# EAGLE design Player Module (EAGLE 9.3.0)
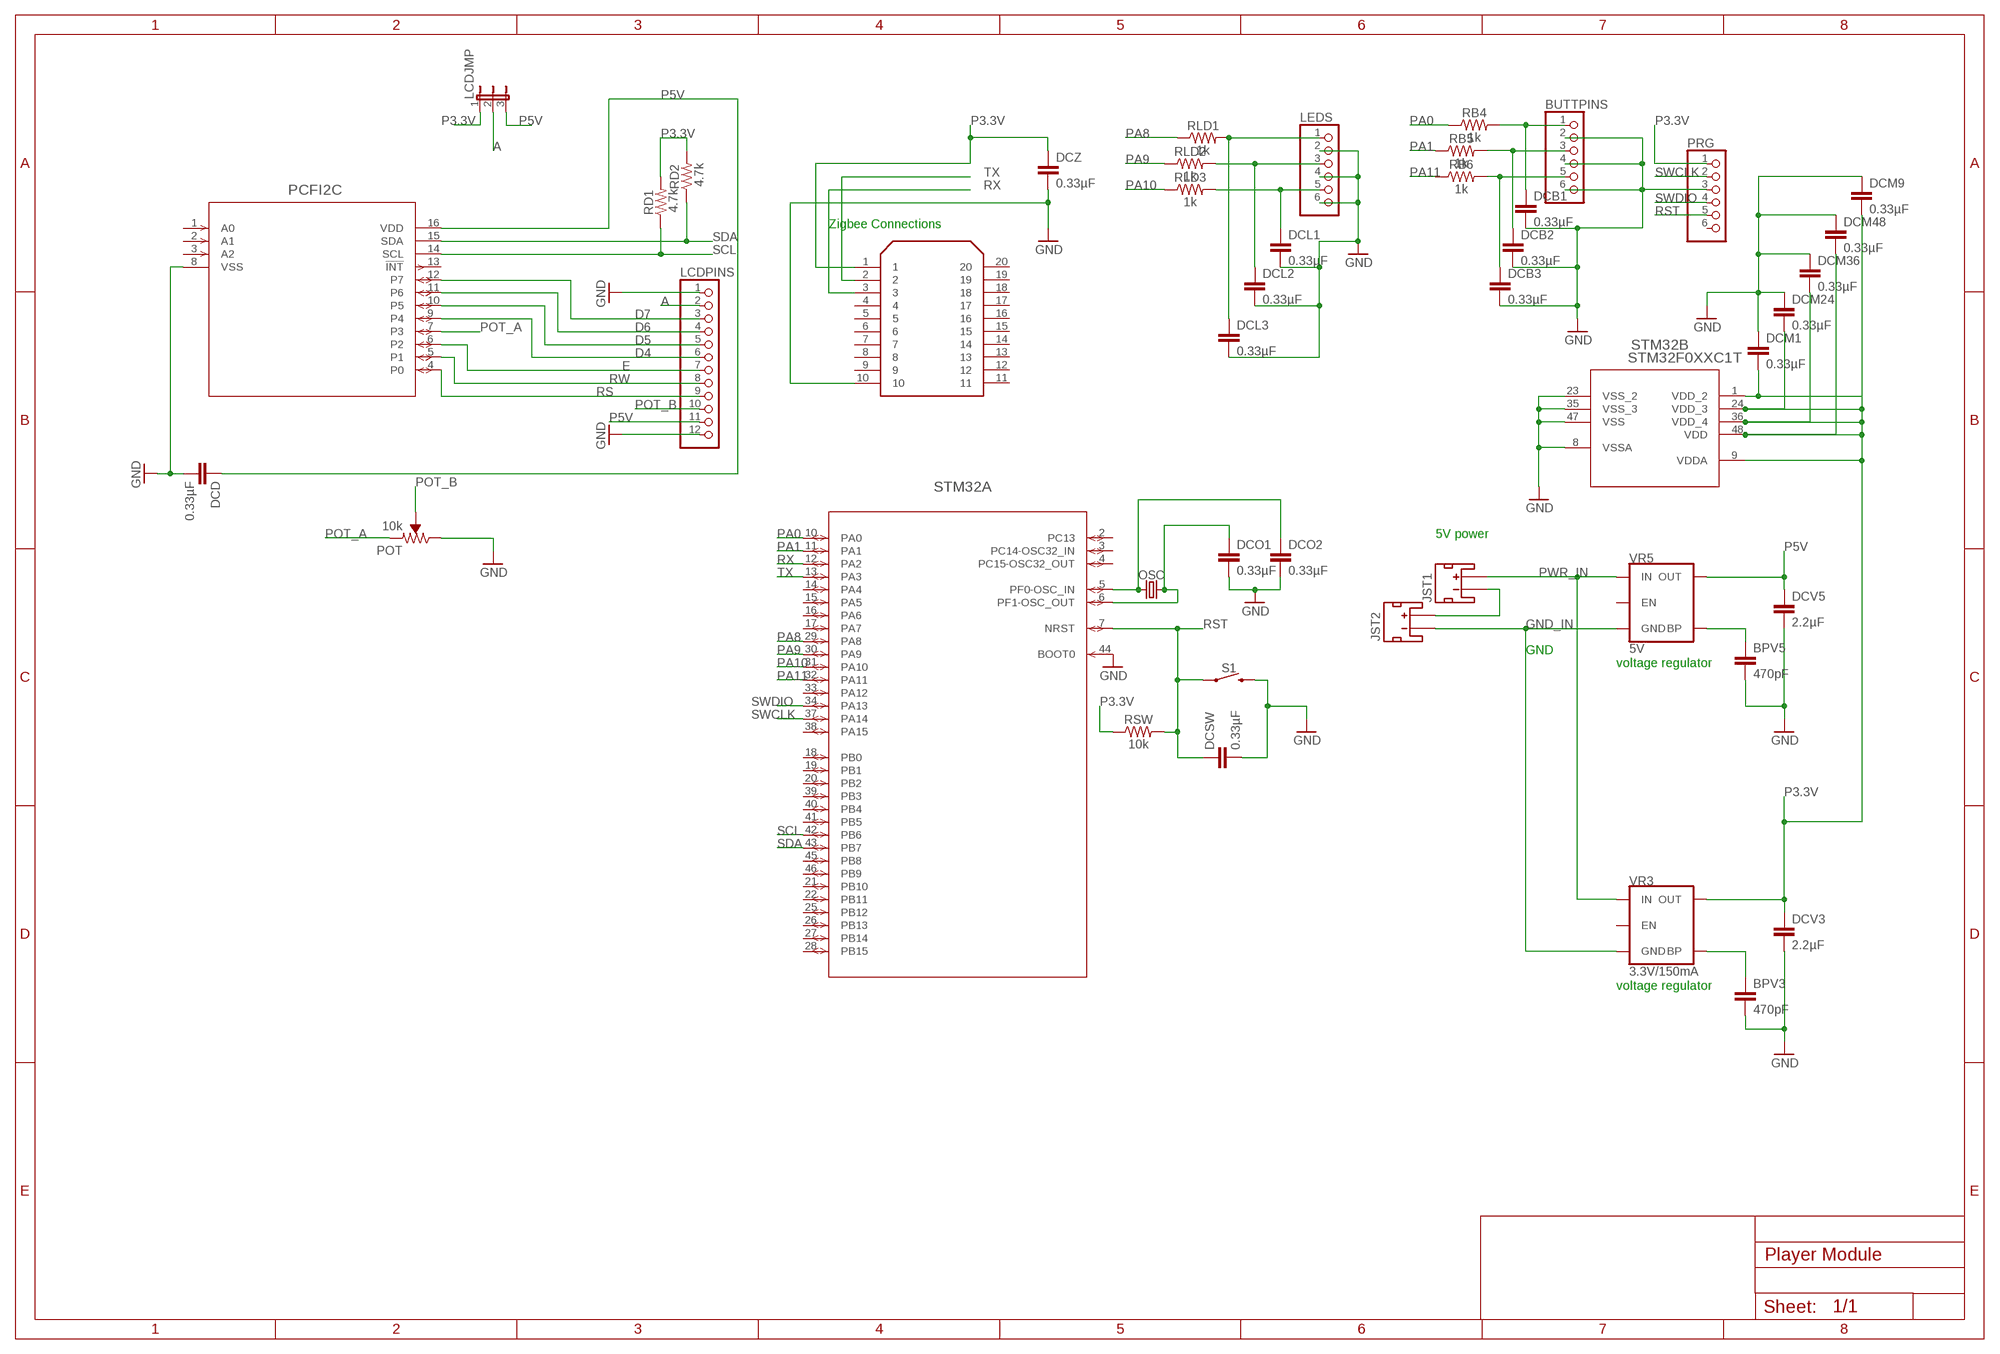
[diagram p0: schematic, sheet 1]

## Parts
BPV3  470pF  0.33UF/330NF-0805-50V-10%  [0805]
BPV5  470pF  0.33UF/330NF-0805-50V-10%  [0805]
BUTTPINS  PINHD-1X6  [1X06]
DCB1  0.33µF  0.33UF/330NF-0805-50V-10%  [0805]
DCB2  0.33µF  0.33UF/330NF-0805-50V-10%  [0805]
DCB3  0.33µF  0.33UF/330NF-0805-50V-10%  [0805]
DCD  0.33µF  0.33UF/330NF-0805-50V-10%  [0805]
DCL1  0.33µF  0.33UF/330NF-0805-50V-10%  [0805]
DCL2  0.33µF  0.33UF/330NF-0805-50V-10%  [0805]
DCL3  0.33µF  0.33UF/330NF-0805-50V-10%  [0805]
DCM1  0.33µF  0.33UF/330NF-0805-50V-10%  [0805]
DCM9  0.33µF  0.33UF/330NF-0805-50V-10%  [0805]
DCM24  0.33µF  0.33UF/330NF-0805-50V-10%  [0805]
DCM36  0.33µF  0.33UF/330NF-0805-50V-10%  [0805]
DCM48  0.33µF  0.33UF/330NF-0805-50V-10%  [0805]
DCO1  0.33µF  0.33UF/330NF-0805-50V-10%  [0805]
DCO2  0.33µF  0.33UF/330NF-0805-50V-10%  [0805]
DCSW  0.33µF  0.33UF/330NF-0805-50V-10%  [0805]
DCV3  2.2µF  0.33UF/330NF-0805-50V-10%  [0805]
DCV5  2.2µF  0.33UF/330NF-0805-50V-10%  [0805]
DCZ  0.33µF  0.33UF/330NF-0805-50V-10%  [0805]
JST1  JST_2MM_MALE  [JST-2-SMD]
JST2  JST_2MM_MALE  [JST-2-SMD]
LCDJMP  JP2E  [JP2]
LCDPINS  PINHD-1X12  [1X12]
LEDS  PINHD-1X6  [1X06]
OSC  CRYSTALPTH-HC49US  [HC49US]
PCFI2C  PCF8574T/3,512SOT162-1-M  [SOT162-1-M]
POT  10k  TRIMPOT-PTH-10MM-KNOB-1/2W-10%  [TRIMPOT-PTH-3386U]
PRG  PINHD-1X6  [1X06]
RB4  1k  RESISTOR0805  [0805]
RB5  1k  RESISTOR0805  [0805]
RB6  1k  RESISTOR0805  [0805]
RD1  4.7k  RESISTOR0805  [0805]
RD2  4.7k  RESISTOR0805  [0805]
RLD1  1k  RESISTOR0805  [0805]
RLD2  1k  RESISTOR0805  [0805]
RLD3  1k  RESISTOR0805  [0805]
RSW  10k  RESISTOR0805  [0805]
S1  MOMENTARY-SWITCH-SPST-SMD-5.2MM  [TACTILE_SWITCH_SMD_5.2MM]
STM32  STM32F0XXC1T  [LQFP48-7X7MM]
VR3  3.3V/150mA  V_REG_MIC52053.3V  [SOT23-5]
VR5  5V  V_REG_MIC52055V  [SOT23-5]
XBEE  XB24-BPIT-004  [DIP-20]

## Nets
A: LCDJMP.2 LCDPINS.2
D4: LCDPINS.6 PCFI2C.9(P4)
D5: LCDPINS.5 PCFI2C.10(P5)
D6: LCDPINS.4 PCFI2C.11(P6)
D7: LCDPINS.3 PCFI2C.12(P7)
E: LCDPINS.7 PCFI2C.6(P2)
GND: BPV3.2 BPV5.2 BUTTPINS.2 BUTTPINS.4 BUTTPINS.6 DCB1.2 DCB2.2 DCB3.2 DCD.2 DCL1.2 DCL2.2 DCL3.2 DCM1.1 DCM9.1 DCM24.1 DCM36.1 DCM48.1 DCO1.2 DCO2.2 DCSW.2 DCV3.2 DCV5.2 DCZ.2 LCDPINS.1 LCDPINS.12 LEDS.2 LEDS.4 LEDS.6 PCFI2C.8(VSS) POT.3(CW) PRG.3 S1.3 STM32.8(B:VSSA) STM32.23(B:VSS_2) STM32.35(B:VSS_3) STM32.44(A:BOOT0) STM32.47(B:VSS) XBEE.10
GND_IN: JST2.1(-) VR3.2(GND) VR5.2(GND)
N$1: JST1.1(-) JST2.2(+)
N$3: DCL3.1 LEDS.1 RLD1.2
N$4: DCL2.1 LEDS.3 RLD2.2
N$5: DCL1.1 LEDS.5 RLD3.2
N$8: BUTTPINS.1 DCB1.1 RB4.2
N$13: BUTTPINS.3 DCB2.1 RB5.2
N$17: BUTTPINS.5 DCB3.1 RB6.2
N$21: DCO2.1 OSC.1 STM32.5(A:PF0-OSC_IN)
N$22: DCO1.1 OSC.2 STM32.6(A:PF1-OSC_OUT)
N$34: BPV3.1 VR3.4(BP)
N$37: BPV5.1 VR5.4(BP)
P3.3V: DCM1.2 DCM9.2 DCM24.2 DCM36.2 DCM48.2 DCV3.1 DCZ.1 LCDJMP.1 PRG.1 RD1.2 RD2.2 RSW.1 STM32.1(B:VDD_2) STM32.9(B:VDDA) STM32.24(B:VDD_3) STM32.36(B:VDD_4) STM32.48(B:VDD) VR3.5(OUT) XBEE.1
P5V: DCD.1 DCV5.1 LCDJMP.3 LCDPINS.11 PCFI2C.16(VDD) VR5.5(OUT)
PA0: RB4.1 STM32.10(A:PA0)
PA1: RB5.1 STM32.11(A:PA1)
PA8: RLD1.1 STM32.29(A:PA8)
PA9: RLD2.1 STM32.30(A:PA9)
PA10: RLD3.1 STM32.31(A:PA10)
PA11: RB6.1 STM32.32(A:PA11)
POT_A: PCFI2C.7(P3) POT.1(CCW)
POT_B: LCDPINS.10 POT.2(WIPER)
PWR_IN: JST1.2(+) VR3.1(IN) VR5.1(IN)
RS: LCDPINS.9 PCFI2C.4(P0)
RST: DCSW.1 PRG.5 RSW.2 S1.1 STM32.7(A:NRST)
RW: LCDPINS.8 PCFI2C.5(P1)
RX: STM32.12(A:PA2) XBEE.3
SCL: PCFI2C.14(SCL) RD1.1 STM32.42(A:PB6)
SDA: PCFI2C.15(SDA) RD2.1 STM32.43(A:PB7)
SWCLK: PRG.2 STM32.37(A:PA14)
SWDIO: PRG.4 STM32.34(A:PA13)
TX: STM32.13(A:PA3) XBEE.2
Unconnected: JST1.NC1(PAD1) JST1.NC2(PAD2) JST2.NC1(PAD1) JST2.NC2(PAD2) PCFI2C.1(A0) PCFI2C.2(A1) PCFI2C.3(A2) PCFI2C.13(!INT) PRG.6 STM32.2(A:PC13) STM32.3(A:PC14-OSC32_IN) STM32.4(A:PC15-OSC32_OUT) STM32.14(A:PA4) STM32.15(A:PA5) STM32.16(A:PA6) STM32.17(A:PA7) STM32.18(A:PB0) STM32.19(A:PB1) STM32.20(A:PB2) STM32.21(A:PB10) STM32.22(A:PB11) STM32.25(A:PB12) STM32.26(A:PB13) STM32.27(A:PB14) STM32.28(A:PB15) STM32.33(A:PA12) STM32.38(A:PA15) STM32.39(A:PB3) STM32.40(A:PB4) STM32.41(A:PB5) STM32.45(A:PB8) STM32.46(A:PB9) VR3.3(EN) VR5.3(EN) XBEE.4 XBEE.5 XBEE.6 XBEE.7 XBEE.8 XBEE.9 XBEE.11 XBEE.12 XBEE.13 XBEE.14 XBEE.15 XBEE.16 XBEE.17 XBEE.18 XBEE.19 XBEE.20

## Notes on the sheet
- Zigbee Connections
- 5V power
- GND
- voltage regulator
- voltage regulator

## Library data of the parts
BPV3 BPV5 DCV3 DCV5 = SparkFun-Capacitors:0.33UF/330NF: 0.33µF/330nF ceramic capacitors A capacitor is a passive two-terminal electrical component used to store electrical energy temporarily in an electric field.; PROD_ID: CAP-08469; VALUE: 0.33µF
BUTTPINS LEDS PRG = pinhead:PINHD-1X6: PIN HEADER
DCB1-DCB3 DCD DCL1-DCL3 DCM1 DCM9 DCM24 DCM36 DCM48 DCO1 DCO2 DCSW DCZ = SparkFun-Capacitors:0.33UF/330NF: 0.33µF/330nF ceramic capacitors A capacitor is a passive two-terminal electrical component used to store electrical energy temporarily in an electric field.; PROD_ID: CAP-08469
JST1 JST2 = SparkFun-Connectors:JST_2MM_MALE: JST 2MM MALE RA CONNECTOR Two pin, compact surface mount connector. Commonly used as a battery input connection point. We really like the solid locking feeling and high current rating on these small connectors. We use these all the time as battery connectors. Mates to single-cell LiPo batteries. Here is the connector we sell at SparkFun: JST Right Angle Connector - White <https://www.sparkfun.com/products/8612> (PRT-08612) Datasheet <http://www.sparkfun.com/datasheets/Prototyping/Connectors/JST-Horizontal.pdf> It was used on these SparkFun products: SparkFun MOSFET Power Controller <https://www.sparkfun.com/products/11214> (PRT-11214) SparkFun Battery Babysitter - LiPo Battery Manager <https://www.sparkfun.com/products/13777> (PRT-13777) And many, many others that required a lipo battery connection.; PROD_ID: CONN-11443; SF_ID: PRT-08612
LCDJMP = jumper:JP2E: JUMPER
LCDPINS = pinhead:PINHD-1X12: PIN HEADER
OSC = SparkFun-Clocks:CRYSTAL: Crystals (Generic) These are passive quartz crystals, which can be used as a clock source for a microcontroller. Crystal's are two-terminal devices. They require external "load" capacitors to generate an oscillating signal.
PCFI2C = ECE477_Resources:PCF8574T/3,512; MANUFACTURER_PART_NUMBER: PCF8574T3512; VENDOR: NXP
POT = SparkFun-Resistors:TRIMPOT: Trimming Potentiometer (Trimpot) Three-terminal potentiometers, with an adjustable wiper and two adjustable resistors. A pot can be used to create a configurable voltage divider, or as a variable resistor. "Trimpots" are a subset of potentiometers, usually intended for "set-and-forget" applications. They're often more delicate than standard potentiometers - rated for fewer turns. Variants PTH-KNOB - PTH Trimpot w/ finger-adjustable knob Trimpot 10K with Knob <https://www.sparkfun.com/products/9806> (COM-09806) Datasheet <http://www.sparkfun.com/datasheets/Components/General/TSR-3386.pdf> SMD-3MM-CLOSED-FRAME - SMD 3mm Square Closed-Frame Trimpot Used on e.g. EasyDriver - Stepper Motor Driver <https://www.sparkfun.com/products/12779> Datasheet <http://www.bitechnologies.com/pdfs/22.pdf> (22AR10KTR) SMD-5MM - SMD 5mm Square Closed-Frame Trimpot Used on e.g. IOIO-OTG - V2.2 <https://www.sparkfun.com/products/13613> Datasheet <http://www.vishay.com/docs/51008/ts53.pdf> (TS53YL502MR10) SMD-3MM-1/10W-25% - 3mm Square Open-Frame Trimpot Used on e.g. SparkFun Shapeoko <https://www.sparkfun.com/products/13899> Datasheet <http://www.bourns.com/docs/Product-Datasheets/TC33.pdf> (TC33X-2-103E); PROD_ID: RES-09730; SF_SKU: COM-09806
RB4-RB6 RD1 RD2 RLD1-RLD3 RSW = SparkFun-Resistors:RESISTOR: Generic Resistor Package
S1 = SparkFun-Switches:MOMENTARY-SWITCH-SPST: Momentary Switch (Pushbutton) - SPST Normally-open (NO) SPST momentary switches (buttons, pushbuttons). Variants PTH-12MM - 12mm square, through-hole Momentary Pushbutton Switch - 12mm Square <https://www.sparkfun.com/products/9190> (COM-09190) PTH-6.0MM, PTH-6.0MM-KIT - 6.0mm square, through-hole Mini Pushbutton Switch <https://www.sparkfun.com/products/97> (COM-00097) KIT package intended for soldering kit's - only one side of pads' copper is exposed. PTH-RIGHT-ANGLE-KIT - Right-angle, through-hole Right Angle Tactile Button <https://www.sparkfun.com/products/10791> - Used on SparkFun BigTime Watch Kit <https://www.sparkfun.com/products/11734> SMD-12MM - 12mm square, surface-mount Tactile Button - SMD (12mm) <https://www.sparkfun.com/products/12993> (COM-12993) Used on SparkFun PicoBoard <https://www.sparkfun.com/products/11888> SMD-4.5MM - 4.5mm Square Trackball Switch Used on SparkFun Blackberry Trackballer Breakout <https://www.sparkfun.com/products/13169> SMD-4.6MMX2.8MM - 4.60mm x 2.80mm, surface mount Used on SparkFun SAMD21 Mini Breakout <https://www.sparkfun.com/products/13664> SMD-5.2MM, SMD-5.2-REDUNDANT - 5.2mm square, surface-mount Mini Pushbutton Switch - SMD <https://www.sparkfun.com/products/8720> (COM-08720) Used on Arduino Pro Mini <https://www.sparkfun.com/products/11114> REDUNDANT package connects both switch circuits together SMD-6.0X3.5MM - 6.0 x 3.5mm, surface mount Momentary Reset Switch SMD <https://www.sparkfun.com/products/8229> (COM-08229) SMD-6.2MM-TALL - 6.2mm square, surface mount Tactile Button - SMD (6mm) <https://www.sparkfun.com/products/12992> Used on SparkFun Digital Sandbox <https://www.sparkfun.com/products/12651> SMD-RIGHT-ANGLE - Right-angle, surface mount Used on SparkFun Block for Intel® Edison - Arduino <https://www.sparkfun.com/products/13036>; PROD_ID: SWCH-08247; SF_SKU: COM-08720
STM32 = ECE477_Resources:STM32F0XXC1T; MANUFACTURER_PART_NUMBER: stm32f0xxc1t; VENDOR: STMicroelectronics
VR3 = SparkFun-IC-Power:V_REG_MIC5205: V_REG MIC5205 Standard 3.3V, 5V, and Adjustable 150mA LDO voltage regulator in SOT-23 layout. Micrel part MIC5205. BP (by-pass) pin is used to lower output noise with 470pF cap, may be left open. On the adjustable version BP is used to set output.; PROD_ID: VREG-00822
VR5 = SparkFun-IC-Power:V_REG_MIC5205: V_REG MIC5205 Standard 3.3V, 5V, and Adjustable 150mA LDO voltage regulator in SOT-23 layout. Micrel part MIC5205. BP (by-pass) pin is used to lower output noise with 470pF cap, may be left open. On the adjustable version BP is used to set output.; PROD_ID: VREG-00823
XBEE = XB24-BPIT-004:XB24-BPIT-004: Xbee Zb (Zigbee Pro Feature Set), 1mw, Wire Antenna, 250000; AVAILABILITY: Unavailable; DESCRIPTION: Xbee Znet 2.5 _Series 2_, 1mw, Pcb Antenna, 250000 Bps, Rout; MF: Digi International; MP: XB24-BPIT-004; PACKAGE: Module Digi International; PRICE: None

## Board
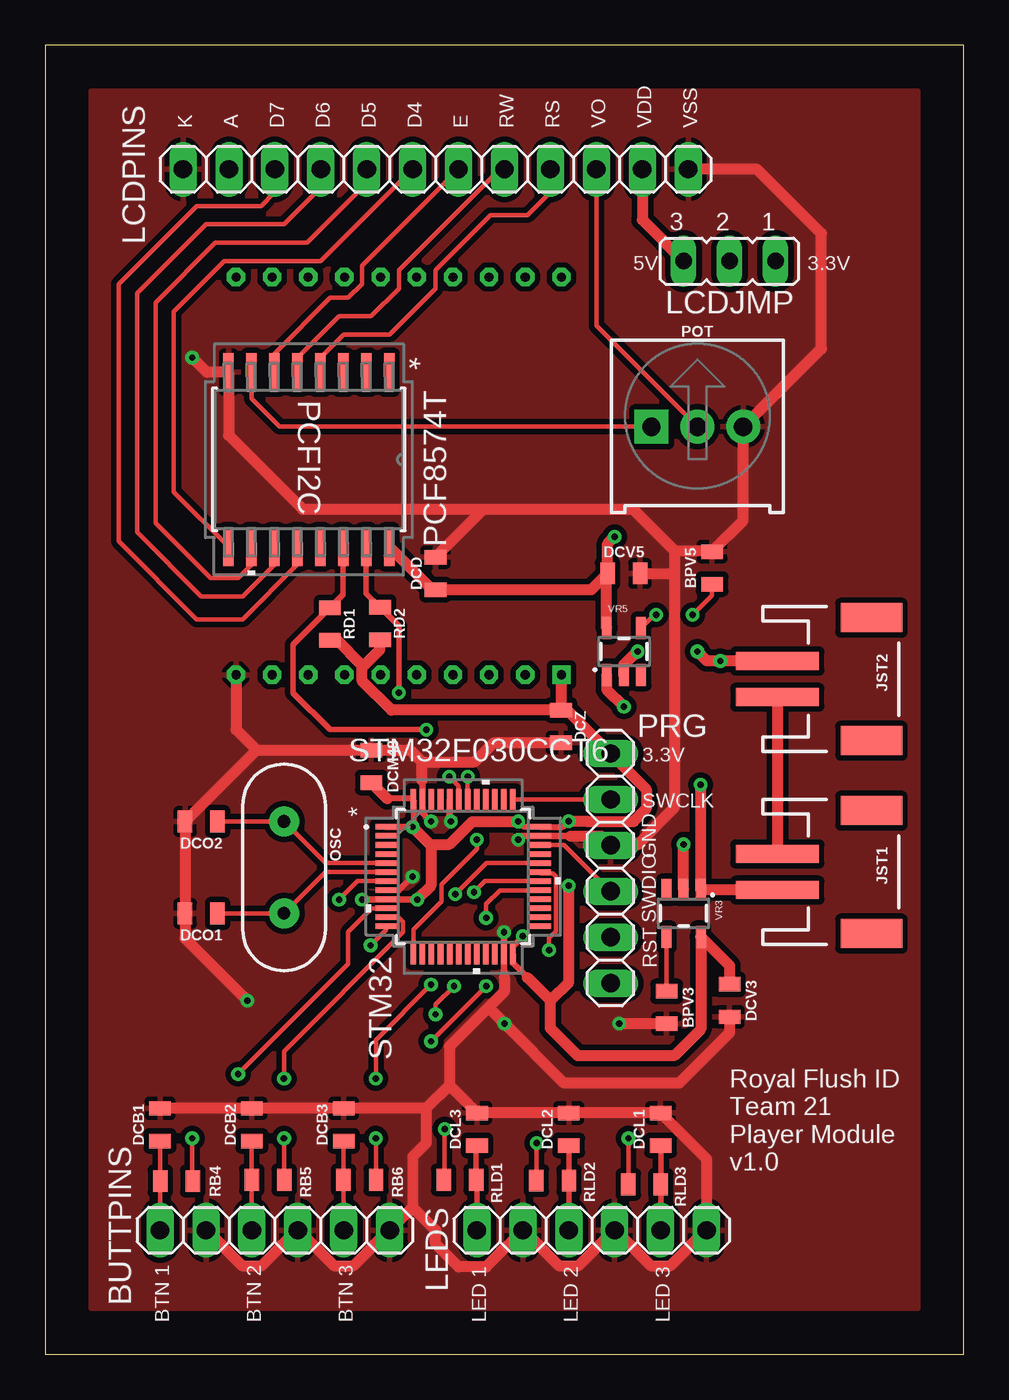
[diagram p1: board, top side]
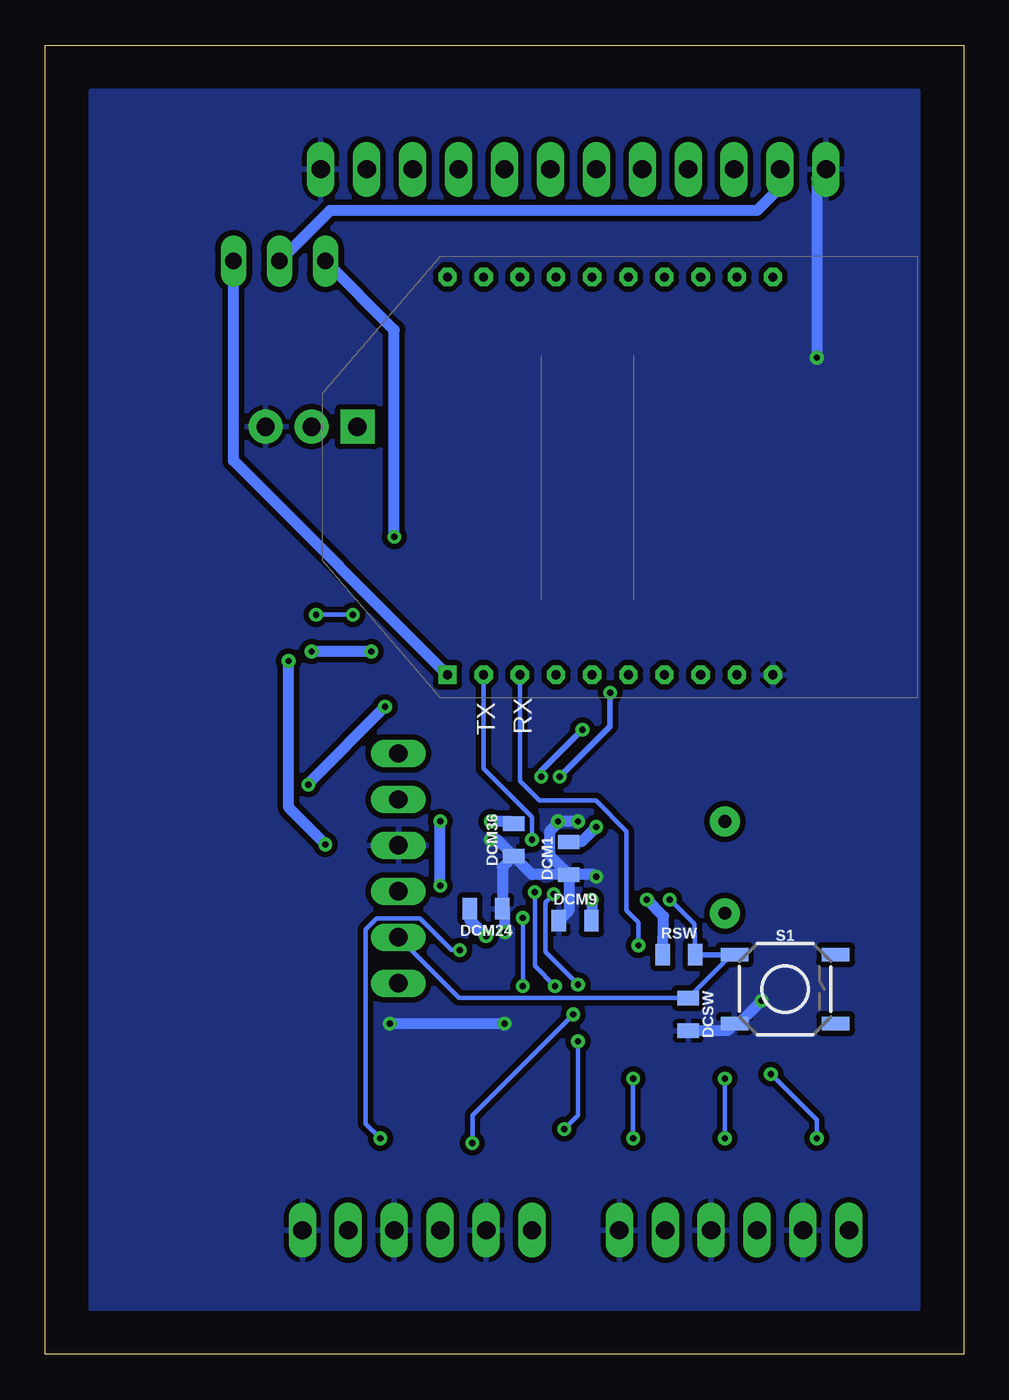
[diagram p2: board, bottom side, seen from below]

Size 50.8 x 72.39 mm. Coordinates in mm from the lower left corner, seen from the top.
Outline: 0,0 50.8,0 50.8,72.39 0,72.39 0,0
Copper layers (1*16): Top 0.035mm / dielectric 1.5mm / Bottom 0.035mm
Design rules "default": minimum track width 6mil, minimum drill 0.35mm, track to track 6mil, track to pad 6mil, pad to pad 6mil, via to via 6mil, smd to smd 6mil, copper to edge 40mil, drill to drill 6mil, minimum pad ring 10mil, minimum via ring 8mil, stop-mask expansion 4mil, vias tented up to drill 0mil, thermal gap 10mil

### Footprints (pad centres in the part's own frame; a part is rotated, then mirrored left to right if it is on the bottom)
0805 = smd 0.8 x 1.2: 1 -0.9,0; 2 0.9,0
1X06 = drill 1.016 long: 1 -6.35,0; 2 -3.81,0; 3 -1.27,0; 4 1.27,0; 5 3.81,0; 6 6.35,0
JST-2-SMD = smd 1 x 4.6: 1 -1,-3.7; 2 1,-3.7 | smd 1.6 x 3.4: NC1 -3.4,1.5; NC2 3.4,1.5
JP2 = drill 0.914 long: 1 -2.54,0; 2 0,0; 3 2.54,0
1X12 = drill 1.016 long: 1 -13.97,0; 2 -11.43,0; 3 -8.89,0; 4 -6.35,0; 5 -3.81,0; 6 -1.27,0; 7 1.27,0; 8 3.81,0; 9 6.35,0; 10 8.89,0; 11 11.43,0; 12 13.97,0
HC49US = drill 0.7 pad 1.651: 1 -2.54,0; 2 2.54,0
SOT162-1-M = smd 2.108 x 0.584: 1 -4.826,4.445; 2 -4.826,3.175; 3 -4.826,1.905; 4 -4.826,0.635; 5 -4.826,-0.635; 6 -4.826,-1.905; 7 -4.826,-3.175; 8 -4.826,-4.445; 9 4.826,-4.445; 10 4.826,-3.175; 11 4.826,-1.905; 12 4.826,-0.635; 13 4.826,0.635; 14 4.826,1.905; 15 4.826,3.175; 16 4.826,4.445
TRIMPOT-PTH-3386U = drill 1.016 pad 1.88 square: 1 -2.54,-0.015 | drill 1.016 pad 1.88: 2 0,-0.015; 3 2.54,-0.015
TACTILE_SWITCH_SMD_5.2MM = smd 1.524 x 0.762: 1 -2.794,1.905; 2 2.794,1.905; 3 -2.794,-1.905; 4 2.794,-1.905
LQFP48-7X7MM = smd 1.194 x 0.305: 1 -4.25,2.75; 2 -4.25,2.25; 3 -4.25,1.75; 4 -4.25,1.25; 5 -4.25,0.75; 6 -4.25,0.25; 7 -4.25,-0.25; 8 -4.25,-0.75; 9 -4.25,-1.25; 10 -4.25,-1.75; 11 -4.25,-2.25; 12 -4.25,-2.75; 25 4.25,-2.75; 26 4.25,-2.25; 27 4.25,-1.75; 28 4.25,-1.25; 29 4.25,-0.75; 30 4.25,-0.25; 31 4.25,0.25; 32 4.25,0.75; 33 4.25,1.25; 34 4.25,1.75; 35 4.25,2.25; 36 4.25,2.75 | smd 0.305 x 1.194: 13 -2.75,-4.25; 14 -2.25,-4.25; 15 -1.75,-4.25; 16 -1.25,-4.25; 17 -0.75,-4.25; 18 -0.25,-4.25; 19 0.25,-4.25; 20 0.75,-4.25; 21 1.25,-4.25; 22 1.75,-4.25; 23 2.25,-4.25; 24 2.75,-4.25; 37 2.75,4.25; 38 2.25,4.25; 39 1.75,4.25; 40 1.25,4.25; 41 0.75,4.25; 42 0.25,4.25; 43 -0.25,4.25; 44 -0.75,4.25; 45 -1.25,4.25; 46 -1.75,4.25; 47 -2.25,4.25; 48 -2.75,4.25
SOT23-5 = smd 0.55 x 1.2: 1 -0.95,-1.3; 2 0,-1.3; 3 0.95,-1.3; 4 0.95,1.3; 5 -0.95,1.3
DIP-20 = drill 0.5 square: 1 1.254,26.009 | drill 0.5 octagon: 2 1.254,24.009; 3 1.254,22.009; 4 1.254,20.009; 5 1.254,18.009; 6 1.254,16.009; 7 1.254,14.009; 8 1.254,12.009; 9 1.254,10.009; 10 1.254,8.009; 11 23.254,8.009; 12 23.254,10.009; 13 23.254,12.009; 14 23.254,14.009; 15 23.254,16.009; 16 23.254,18.009; 17 23.254,20.009; 18 23.254,22.009; 19 23.254,24.009; 20 23.254,26.009

### Placement (x,y rotation side)
BPV3  34.37,19.18 270 top
BPV5  36.88,43.48 90 top
BUTTPINS  12.7,6.86 0 top
DCB1  6.35,12.7 90 top
DCB2  11.43,12.7 90 top
DCB3  16.51,12.7 90 top
DCD  21.59,43.18 90 top
DCL1  34.04,12.45 90 top
DCL2  28.96,12.45 90 top
DCL3  23.88,12.45 90 top
DCM1  21.84,27.43 90 bottom
DCM9  21.49,23.98 0 bottom
DCM24  26.42,24.64 180 bottom
DCM36  24.89,28.45 90 bottom
DCM48  18.03,32.51 270 top
DCO1  8.64,24.38 180 top
DCO2  8.64,29.46 180 top
DCSW  15.24,18.8 270 bottom
DCV3  37.85,19.56 270 top
DCV5  32,43.18 0 top
DCZ  28.52,34.72 270 top
JST1  44.2,26.67 270 top
JST2  44.2,37.34 270 top
LCDJMP  37.85,60.45 180 top
LCDPINS  21.59,65.53 0 top
LEDS  30.23,6.86 0 top
OSC  13.21,26.92 270 top
PCFI2C  14.58,49.48 270 top
POT  36.07,51.31 0 top
PRG  31.27,26.87 270 top
RB4  7.26,9.58 180 top
RB5  12.32,9.65 180 top
RB6  17.4,9.65 180 top
RD1  15.75,40.39 270 top
RD2  18.52,40.41 270 top
RLD1  22.94,9.65 0 top
RLD2  28.07,9.6 0 top
RLD3  33.15,9.4 0 top
RSW  15.75,22.1 0 bottom
S1  9.88,20.19 0 bottom
STM32  23.11,26.42 0 top
VR3  35.31,24.38 180 top
VR5  32,38.86 0 top
XBEE  2.54,36.32 90 bottom

### Tracks (layer width: path | path; a pad name or v marks a point on that pad's centre or on a via)
A
  Bottom 0.61: LCDPINS.2 10.16,64.52 11.43,63.25 35.05,63.25 LCDJMP.2
D4
  Top 0.254: PCFI2C.9 7.11,47.68 7.11,57.66 9.91,60.45 15.24,60.45 LCDPINS.6
D5
  Top 0.254: PCFI2C.10 11.4,43.66 10.67,42.93 9.14,42.93 6.1,45.97 6.1,58.17 9.4,61.47 14.48,61.47 17.78,64.77 LCDPINS.5
D6
  Top 0.254: PCFI2C.11 12.68,43.66 10.92,41.91 8.64,41.91 5.08,45.47 5.08,58.67 8.89,62.48 13.21,62.48 15.24,64.52 LCDPINS.4
D7
  Top 0.254: PCFI2C.12 13.95,43.66 10.92,40.64 8.38,40.64 4.06,44.96 4.06,59.18 8.38,63.5 11.94,63.5 12.7,64.26 LCDPINS.3
E
  Top 0.254: PCFI2C.6 12.68,55.35 15.75,58.42 16.76,58.42 17.53,59.18 17.53,60.2 LCDPINS.7
GND  (via drill 0.35)
  Top 0.33: STM32.8 19.57,25.67 v20.32,26.42
  Top 0.356: v21.34,29.46 20.86,29.94 STM32.47 20.86,31.71 20.83,31.75 | 29.04,28.67 STM32.35 26.38,28.67 v26.16,28.45 | v25.38,23.34 v25.36,23.33 STM32.23 25.36,20.86 25.4,20.83 | STM32.44 22.36,29.54 v22.44,29.46
  Top 0.406: 29.04,28.67 29.06,28.65
  Top 0.61: 29.06,28.65 30.76,28.65 PRG.3 32.72,28.14 34.8,30.23 34.8,43.12 | 20.83,32.77 20.18,33.41 DCM48.1 11.68,33.41 | 20.83,31.75 20.83,32.77 | 20.83,32.77 23.76,32.77 24.81,33.82 DCZ.2 | 11.68,33.41 DCO2.2 DCO1.2 7.74,23 v11.18,19.56 | 24.51,19.18 25.4,20.07 25.4,20.83 | 24.51,19.18 22.35,17.02 22.35,14.87 | 24.51,19.18 v25.4,18.29 28.7,14.99 35.05,14.99 37.85,17.78 DCV3.2 | v31.75,18.29 34.35,18.29 BPV3.2 | DCV5.2 34.73,43.18 34.8,43.12 | 22.35,14.87 DCL3.2 DCL2.2 DCL1.2 36.58,10.81 LEDS.6 36.52,6.86 34.54,4.88 33.53,4.88 31.55,6.86 LEDS.4 31.44,6.86 29.46,4.88 28.45,4.88 26.47,6.86 LEDS.2 24.38,4.83 22.86,4.83 21.59,6.1 21.59,6.86 20.32,8.13 | 22.35,14.87 21.07,13.59 | 21.07,13.59 16.52,13.59 DCB3.2 DCB2.2 DCB1.2 | 21.07,13.59 21.07,11.67 20.32,10.92 20.32,8.13 | 20.32,8.13 BUTTPINS.6 19,6.86 17.02,4.88 16,4.88 14.02,6.86 BUTTPINS.4 13.92,6.86 11.94,4.88 10.93,4.88 8.94,6.86 BUTTPINS.2 | XBEE.10 10.55,34.55 11.68,33.41 | 24.25,46.74 DCD.2 | 24.25,46.74 32.51,46.74 34.8,44.45 | LCDPINS.12 39.37,65.53 42.93,61.98 42.93,55.61 POT.3 38.61,46.11 BPV5.2 36.82,44.45 34.8,44.45 | v8.13,55.12 8.94,54.3 PCFI2C.8 10.13,50.83 14.22,46.74 24.25,46.74 | 34.8,44.45 34.8,43.12
  Bottom 0.61: v20.32,26.42 20.44,26.53 DCM1.1 | DCM1.1 21.84,24.52 DCM9.1 | v21.34,29.46 v22.44,29.46 22.44,29.39 22.9,28.92 22.9,27.59 DCM1.1 | v25.38,23.34 25.38,24.5 DCM24.1 25.52,26.92 DCM36.1 | v11.18,19.56 12.45,18.29 S1.3 13.07,17.9 DCSW.2 | v31.75,18.29 v25.4,18.29 | DCM36.1 25.79,28.45 v26.16,28.45 | DCM1.1 23.88,26.53 DCM36.1 | LCDPINS.1 8.13,65.02 v8.13,55.12
  pour Bottom (isolate 0.305): 2.54,69.85 48.26,69.85 48.26,2.54 2.54,2.54
  pour Top (isolate 0.305): 2.54,69.85 48.26,69.85 48.26,2.54 2.54,2.54
GND_IN  (via drill 0.35)
  Top 0.61: v32.77,38.86 32.52,38.62 32.49,38.62 32,38.13 VR5.2 | JST2.1 v37.34,38.34 36.59,38.34 v36.07,38.86 | VR3.2 v35.31,28.19
  Bottom 0.61: v32.77,38.86 v36.07,38.86 | v35.31,28.19 37.34,30.23 v37.34,38.34
N$1
  Top 0.61: JST2.2 JST1.1
N$3
  Top 0.305: LEDS.1 23.88,9.61 RLD1.2 23.84,11.51 DCL3.1
N$4
  Top 0.305: LEDS.3 RLD2.2 28.97,11.54 DCL2.1
N$5
  Top 0.305: LEDS.5 RLD3.2 34.05,11.54 DCL1.1
N$8
  Top 0.254: DCB1.1 RB4.2 6.36,6.87 BUTTPINS.1
N$13
  Top 0.254: DCB2.1 11.43,9.66 RB5.2 BUTTPINS.3
N$17
  Top 0.254: DCB3.1 16.51,9.66 RB6.2 16.5,6.87 BUTTPINS.5
N$21
  Top 0.254: STM32.5 15.51,27.17 OSC.1 DCO2.1
N$22
  Top 0.254: STM32.6 15.49,26.67 OSC.2 DCO1.1
N$34
  Top 0.254: VR3.4 34.36,20.09 BPV3.1
N$37  (via drill 0.35)
  Top 0.254: VR5.4 33.69,40.89 v33.78,40.89 | v35.81,40.89 36.88,41.96 BPV5.1
  Bottom 0.254: v33.78,40.89 v35.81,40.89
P3.3V  (via drill 0.35)
  Top 0.33: v26.42,23.11 25.86,22.56 STM32.24 25.86,21.63 26.67,20.83 | v26.16,29.46 26.46,29.17 STM32.36 28.64,29.17 v28.96,29.49 | v20.31,29.17 20.36,29.22 STM32.48 20.3,30.73 18.91,30.73
  Top 0.356: v20.57,25.15 20.55,25.17 STM32.9 17.55,25.17 v17.53,25.15 | STM32.1 v20.31,29.17
  Top 0.406: v20.31,29.17 v20.32,29.16
  Top 0.61: 18.91,30.73 DCM48.2 | v28.96,25.91 28.96,20.57 27.94,19.56 | v26.16,29.46 23.62,29.46 22.35,28.19 21.29,28.19 | v20.57,25.15 21.34,25.91 21.34,28.14 21.29,28.19 | 26.67,20.83 27.94,19.56 | v28.96,29.49 29.98,29.49 30,29.46 32.53,29.46 33.25,30.18 33.25,31.24 PRG.1 28.87,35.62 DCZ.1 | v20.32,29.16 21.29,28.19 | DCV3.1 37.85,21.49 VR3.5 36.26,17.97 34.8,16.51 29.46,16.51 27.94,18.03 27.94,19.56 | XBEE.1 28.52,37.55 DCZ.1 | 17.54,38.09 17.54,37.23 19.14,35.62 DCZ.1 | RD1.2 16.14,39.49 17.54,38.09 | 17.54,38.09 17.59,38.04 18.52,38.97 RD2.2
  Bottom 0.61: RSW.1 16.6,24.22 v17.53,25.15 | v20.57,25.15 20.57,23.99 DCM9.2 | v26.42,23.11 27.32,24.01 DCM24.2 | v28.96,25.91 v28.96,29.49 | v20.32,29.16 21.15,28.33 DCM1.2 | DCM36.2 25.01,29.46 v26.16,29.46 | XBEE.1 40.39,49.41 LCDJMP.1
P5V  (via drill 0.35)
  Top 0.61: VR5.5 31.05,43.13 | 31.05,43.13 DCV5.1 31.1,44.82 v31.5,45.21 | PCFI2C.16 21.4,42.28 DCD.1 30.2,42.28 31.05,43.13 | LCDPINS.11 33.02,62.74 LCDJMP.3
  Bottom 0.61: v31.5,45.21 31.5,56.64 LCDJMP.3
PA0  (via drill 0.35)
  Top 0.254: STM32.10 18.06,24.66 16.76,23.37 16.76,21.59 v10.67,15.49 | v8.13,11.94 8.13,9.61 RB4.1
  Bottom 0.254: v10.67,15.49 8.13,12.95 v8.13,11.94
PA1  (via drill 0.35)
  Top 0.254: STM32.11 19.46,24.17 19.47,24.17 19.53,24.17 19.79,23.91 19.79,23.35 13.21,16.76 v13.21,15.24 | v13.21,11.94 13.21,9.66 RB5.1
  Bottom 0.254: v13.21,15.24 v13.21,11.94
PA8  (via drill 0.35)
  Top 0.254: STM32.29 27.35,25.65 25.15,25.65 24.38,24.89 v24.38,24.13 | v24.38,20.35 v21.34,17.31 | v22.1,12.45 22.1,9.71
  Top 0.305: 22.1,9.71 RLD1.1
  Bottom 0.254: v24.38,24.13 v24.38,20.35 | v21.34,17.31 21.34,13.21 v22.1,12.45
PA9  (via drill 0.35)
  Top 0.254: STM32.30 24.33,26.17 v23.72,25.56 | v22.61,20.35 21.59,19.34 v21.59,18.8 | v27.18,11.68 27.18,9.61
  Top 0.305: 27.18,9.61 RLD2.1
  Bottom 0.254: v23.72,25.56 23.72,21.47 v22.61,20.35 | v21.59,18.8 27.18,13.21 v27.18,11.68
PA10  (via drill 0.35)
  Top 0.254: STM32.31 27.43,26.6 28.08,26.6 28.24,26.43 28.24,23.4 27.87,23.02 v27.87,22.35 | v32.26,11.94 RLD3.1
  Top 0.305: RLD3.1
  Bottom 0.254: v27.87,22.35 28.32,22.35 30.07,24.11 32.46,24.11 33.07,23.5 33.07,12.75 v32.26,11.94
PA11  (via drill 0.35)
  Top 0.254: v22.68,25.45 24.4,27.17 STM32.32 | v21.34,20.45 18.29,17.4 v18.29,15.24 | v18.29,11.94 18.3,11.93 RB6.1
  Bottom 0.254: v22.68,25.45 23.14,24.99 23.14,22.25 v21.34,20.45 | v18.29,15.24 v18.29,11.94
POT_A
  Top 0.254: PCFI2C.7 11.4,52.86 12.97,51.29 POT.1
POT_B
  Top 0.254: LCDPINS.10 30.48,56.88 POT.2
PWR_IN  (via drill 0.35)
  Top 0.61: JST1.2 VR3.1 36.25,25.69 v36.25,31.5 | VR5.1 31.05,36.76 v32,35.81
  Bottom 0.61: v32,35.81 36.25,31.57 v36.25,31.5
RS
  Top 0.254: PCFI2C.4 15.21,55.09 16.51,56.39 19.05,56.39 21.59,58.93 21.59,59.94 24.64,62.99 26.67,62.99 27.94,64.26 LCDPINS.9
RST  (via drill 0.35)
  Top 0.254: STM32.7 17.28,26.17 v16.26,25.15
  Bottom 0.254: RSW.2 14.9,23.79 v16.26,25.15 | 12.95,22.1 12.95,21.98 DCSW.1 27.9,19.7 PRG.5
  Bottom 0.305: S1.1 12.95,22.1 RSW.2
RW
  Top 0.254: PCFI2C.5 13.95,55.09 16.26,57.4 18.03,57.4 19.56,58.93 19.56,59.94 25.15,65.53 LCDPINS.8
RX  (via drill 0.35)
  Top 0.254: STM32.12 18.86,23.48 v17.99,22.61
  Bottom 0.254: v17.99,22.61 17.99,23.88 18.65,24.53 18.65,28.92 20.35,30.63 23.47,30.63 24.55,31.7 XBEE.3
SCL  (via drill 0.35)
  Top 0.254: STM32.42 v23.36,31.93 v23.37,31.93
  Top 0.305: PCFI2C.14 16.48,42.02 RD1.1 13.72,39.25 13.72,36.58 15.75,34.54 v21.08,34.54
  Bottom 0.305: v21.08,34.54 23.37,32.26 v23.37,31.93
SDA  (via drill 0.35)
  Top 0.254: v22.35,31.93 22.86,31.42 STM32.43
  Top 0.305: PCFI2C.15 17.75,42.07 RD2.1 19.56,40.27 v19.56,36.58
  Bottom 0.305: v22.35,31.93 19.56,34.73 v19.56,36.58
SWCLK
  Top 0.254: STM32.37 25.88,30.68 PRG.2
SWDIO
  Top 0.254: STM32.34 28.7,28.17 PRG.4
TX  (via drill 0.35)
  Top 0.254: v23.88,28.45 23.88,27.94 21.92,25.98 21.92,25.05 20.36,23.5 STM32.13
  Bottom 0.254: XBEE.2 26.55,32.39 24.71,30.56 24.7,30.56 23.88,29.73 v23.88,28.45

### Text on the board
tPlace: K | A | D7 | D6 | D5 | D4 | E | RW | RS | VO | VDD | VSS | 5V | 3.3V | 3.3V | * | SWCLK | GND | RST | SWDIO | Royal Flush ID / Team 21 / Player Module / v1.0 | BTN 1 | BTN 2 | BTN 3 | LED 1 | LED 2 | LED 3
bPlace: RX | TX